# Altium schematic sheet Temperature sensor - TC1046VNBTR.SchDoc: Temperature sensor - Analog out
size A4; Organization: Altium Limited; Address1: 3 Minna Close; Address2: Belrose; Address3: NSW 2085; Address4: Australia
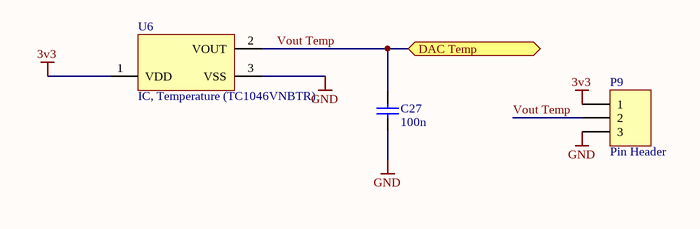
[diagram p0: Temperature sensor - TC1046VNBTR.SchDoc]

## Parts
C27  100n  [C0805]
P9  Pin Header  [PH1x3_2.54]
U6  IC, Temperature (TC1046VNBTR)  [SOT-23-NB3_M]

## Ports
DAC Temp

## Nets
3v3: P9.1 U6.1(VDD)
GND: C27.1 P9.3 U6.3(VSS)
Vout Temp: C27.2 P9.2 U6.2(VOUT) ; port DAC Temp

## Notes on the sheet
- Title
- Size:
- Date:
- A4
- Name:
- Time:
- Ing. W. Pietersz
- Revision:
- Sheet
- of
- WillyPietersz@gmail.com
- Contact:
- -
- www.wnpd.nl
- Disclaimer
  Any design and information, hardware or software  is provided on an "as-is" basis without warranty of any kind and any express or implied warranties, including, but not limited to, the implied warranties of merchantability and fitness for a particular purpose are disclaimed. In no event shall wnpd (or KeaDrone)be liable for any direct, indirect, incidental, special, exemplary, or consequential damages (including, but not limited to, procurement of substitute goods or services; loss of use, data, or profits; or business interruption) however caused and on any theory of liability, whether in contract, strict liability, or tort (including negligence or otherwise) arising in any way out of the use of this firmware, hardware, software or information, even if wnpd (or KeaDrone) has been advised by user of the possibility of such potential loss or damage. The user agrees to hold wnpd (or KeaDrone) harmless from and against any and all claims, losses, liabilities and expenses.
- File:

## Library data of the parts
C27 = 100n: Tolerance: 0.1; LatestRevision Note: Initial Release; Part Number: 100n; Value: 100n; Package: 0805; Component Type: Standard; LatestRevision Date: 31-7-2010; Author: Willy Pietersz; Supplier 2: Farnell; Supplier Part Number 2: 1759266; ComponentLink1Description: Manufacturer; ComponentLink2Description: Datasheet
P9 = PH1x3: Con1x3; Part Number: PH1x3; Pitch: 2.54; LatestRevision Note: Initial Release; Type: Pin Header; Number Of Pins: 3; Component Type: Standard; LatestRevision Date: 23-11-2010; Author: Willy Pietersz; Supplier 2: Farnell
U6 = TC1046VNBTR: High Precision Temperature-to-Voltage Converter, 3-Pin SOT-23, Extended Temperature, Tape and Reel; FirstPublished: 29-Jan-2009; DatasheetVersion: revB, Feb-2003; PackageVersion: revBB, Aug-2009; PackageReference: SOT-23-NB3; Publisher: Altium Limited; PackageDescription: 3-Lead Plastic Small Outline Transistor (NB) [SOT-23]; Supplier 1: Digi-Key; Supplier Part Number 1: TC1046VNBTRTR-ND; Supplier 2: Digi-Key; Supplier Part Number 2: TC1046VNBTRCT-ND; Supplier 3: Digi-Key; Supplier Part Number 3: TC1046VNBTRDKR-ND; Supplier 4: Farnell; Supplier Part Number 4: 1212685; Supplier 5: Newark; Supplier Part Number 5: 89C8092; Code_IPC: SOT23-3; ComponentLink1Description: Datasheet; ComponentLink1URL: http://ww1.microchip.com/downloads/en/DeviceDoc/21496b.pdf; ComponentLink2Description: Packaging Specification; ComponentLink2URL: http://www.microchip.com/stellent/groups/techpub_sg/documents/packagingspec/en012702.pdf; ComponentLink3Description: Microchip.com Home; ComponentLink3URL: http://www.microchip.com/